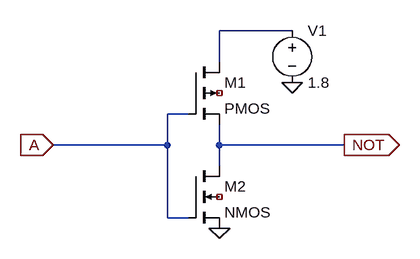
[diagram p0: schematic NOT.asc]
NOT.asc, the LTspice schematic file:
Version 4
SHEET 1 880 680
WIRE 272 0 160 0
WIRE 160 48 160 0
WIRE 112 128 80 128
WIRE 80 176 80 128
WIRE 80 176 -96 176
WIRE 160 176 160 144
WIRE 352 176 160 176
WIRE 160 208 160 176
WIRE 80 288 80 176
WIRE 112 288 80 288
FLAG 272 80 0
FLAG 160 304 0
FLAG -96 176 A
IOPIN -96 176 In
FLAG 352 176 NOT
IOPIN 352 176 Out
SYMBOL pmos4 112 48 R0
SYMATTR InstName M1
SYMBOL nmos4 112 208 R0
SYMATTR InstName M2
SYMBOL voltage 272 -16 R0
WINDOW 123 0 0 Left 0
WINDOW 39 0 0 Left 0
SYMATTR InstName V1
SYMATTR Value 1.8

The netlist it stands for:
* NOT.asc
M1 N001 A NOT NC_01 PMOS
M2 NOT A 0 NC_02 NMOS
V1 N001 0 1.8
.model NMOS NMOS
.model PMOS PMOS
.lib standard.mos
.backanno
.end